# Altium schematic sheet CR.SchDoc
size A4
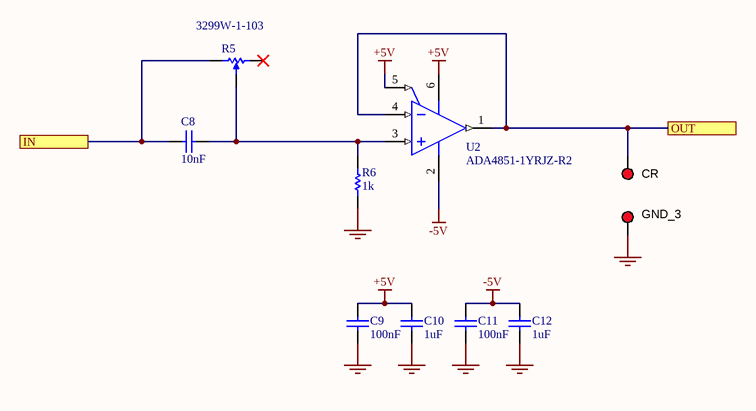
[diagram p0: CR.SchDoc]

## Parts
C8  10nF  [CAPC0603(1608)100_N]
C9  100nF  [CAPC0603(1608)100_N]
C10  1uF  [CAPC0603(1608)100_N]
C11  100nF  [CAPC0603(1608)100_N]
C12  1uF  [CAPC0603(1608)100_N]
CR  5010  [KSTN-5010_V]  (value not drawn)
GND_3  5010  [KSTN-5010_V]  (value not drawn)
R5  3299W-1-103  [BOUR-3299W-3_V]
R6  1k  [RESC0603(1608)_N]
U2  ADA4851-1YRJZ-R2  [ADI-RJ-6_N]

## Ports
IN, OUT

## Nets
+5V: C9.2 C10.2 U2.5(~{POWER_DOWN}) U2.6(+VS)
-5V: C11.2 C12.2 U2.2(-VS)
GND: C9.1 C10.1 C11.1 C12.1 GND_3.1 R6.1
IN: C8.2 R5.1 ; port IN
OUT: CR.1 U2.1(VOUT) U2.4(-IN) ; port OUT
NetC8_1: C8.1 R5.2 R6.2 U2.3(+IN)

Not connected (* = marked no-connect by the designer): R5 3*

## Library data of the parts
C8 = CMP-1035-02589-1: 10nF Film; Value: 100nF; Case-EIA: 0603; Rated Voltage: 25 V; Tolerance: Â±20%; Case-Metric: 1608; Max Thickness: 1 mm; Technology: SMT
C9 C11 = CMP-1035-02589-1: CAP 100nF 25V ±20% 0603 (1608 Metric) Thickness 1mm SMD; Case-EIA: 0603; Tolerance: Â±20%; Case-Metric: 1608; Value: 100nF; Max Thickness: 1 mm; Technology: SMT; Rated Voltage: 25 V
C10 C12 = CMP-1035-02589-1: CAP 1uF 25V ±20% 0603 (1608 Metric) Thickness 1mm SMD; Value: 100nF; Case-EIA: 0603; Tolerance: Â±20%; Case-Metric: 1608; Max Thickness: 1 mm; Technology: SMT; Rated Voltage: 25 V
CR GND_3 = CMP-1672-00002-3: Test Point, Red, Through Hole, RoHS, Bulk; REACH SVHC: No SVHC; Contact Material: Bronze; PackageDescription: 1-Pin Through Hole Device, Dia 3.17 mm; Mounting Technology: Through Hole; Colour: Red; PackageReference: 5010; Height: 8.12 mm; Pins: 1; RoHSCompliant: true; Package Quantity: 100; Packaging: Bulk; Mount: Through Hole; DatasheetVersion: Rev. F, 12/2013; Contact Plating: Silver
R5 = CMP-2000-05584-1: Square Trimpot(R) Trimming Potentiometer, 10 KOhm, +/- 10%, 500 mW, -55 to 125 degC, 3-Pin THD, RoHS, Tube; Element Type: Cermet; Unit Weight: 0.035000oz; Brand: Bourns; Power Rating: 500mW(1/2W); Resistance: 10kOhms; Qualification: Commercial; Adjustment: TopCrossed; Datasheet Version: 04/2014; Product Category: TrimmerResistors-ThroughHole; Mounting Technology: ThroughHole; Manufacturer URL: http://www.bourns.com/; Package Description: 3-Pin Surface Mount Device, Body 9.53 x 6.1 mm, Pitch 2.54 mm; Product: Multiturn; Length: 10.03mm; Termination Style: Pin; Tradename: Trimpot; Type: Trimmers; Manufacturer: Bourns; Width: 9.53mm; Mounting: PanelMount; RoHS: No / RoHSVersionAvailable; Taper: Linear; Datasheet URL: http://www.bourns.com/docs/Product-Datasheets/3299.pdf; Product Type: SquareTrimmingPotentiometer; Package Reference: 3299W; Tolerance: 10%; Series: 3299; Operating Temperature Range: -55Cto+125C; Packaging: Tube
R6 = CMP-1012-00397-1: 1k 1% Metal film; Value: 100.00 Ohm; Case-EIA: 0603; Power: 0.1 W; Case-Metric: 1608; Technology: SMT; Tolerance: 1 %
U2 = CMP-0384-01563-2: Single Channel Low Power Operational Amplifier, 130 MHz BW, 375 V/us SR, Industrial, 6-pin SOT23 (RJ-6), Reel; Manufacturer: Analog Devices; V Span Max: 12V; Amplifiers Per Package: 1; Iq/Amp: 3.2mA; Small Signal Bandwidth: 130MHz; Automotive Qualified: Yes; Input Offset Voltage: 600uV; Input Bias Current: 2.2uA; V Span Min: 2.7V; DatasheetVersion: Rev. J; PartNumber: ADA4851-1YRJZ-R2; ComponentLink2Description: Datasheet; ComponentLink1URL: http://www.analog.com/en/index.html; ComponentLink3URL: http://www.analog.com/static/imported-files/packages/PKG_PDF/SOT-23(RJ)/RJ_6.pdf; ComponentLink3Description: Package Specification; ComponentLink1Description: Manufacturer URL; Mounting Technology: Surface Mount; Code_JEDEC: MO-178-AB; Generic Part Number: ADA4851-1; PackageReference: RJ-6; RevisionNote: Reference Circuit URL fixed; ComponentLink4URL: http://www.analog.com/en/all-operational-amplifiers-op-amps/operational-amplifiers-op-amps/ada4851-1/products/product.html#product-recommendations; Slew Rate: 375V/us; ComponentLink4Description: Reference Circuit; ComponentLink2URL: http://www.analog.com/static/imported-files/data_sheets/ADA4851-1_4851-2_4851-4.pdf; PackageDescription: 6-Pin Small Outline Transistor Package, Body 2.9 x 1.6 mm, Pitch 0.95 mm; PackageVersion: 121608-A